# Altium schematic sheet ST_LINK_V2-1.SCHDOC: ST-LINK/V2-1
size A4; DocumentNumber: MB1219; Revision: B.1; SheetNumber: 15; SheetTotal: 17; Project: STM32F769I-EVAL
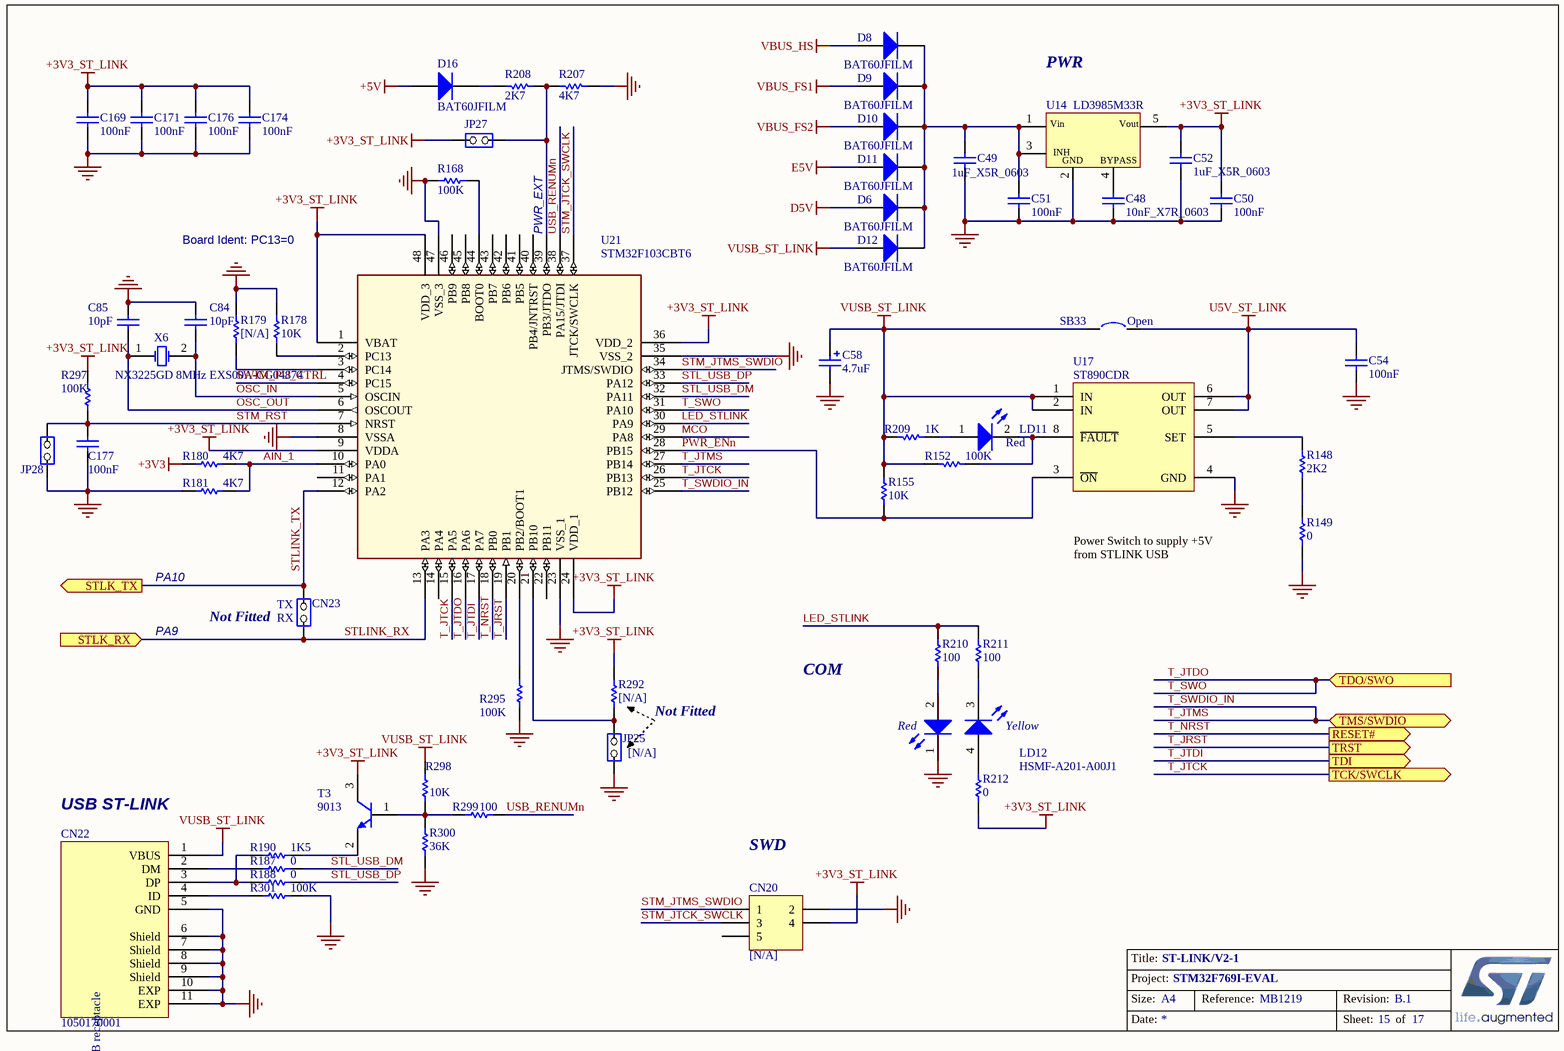
[diagram p0: ST_LINK_V2-1.SCHDOC]

## Parts
C48  10nF_X7R_0603  [0603C]
C49  1uF_X5R_0603  [0603C]
C50  100nF  [0603C]
C51  100nF  [0603C]
C52  1uF_X5R_0603  [0603C]
C54  100nF  [0603C]
C58  4.7uF  [TAN-A]
C84  10pF  [0603C]
C85  10pF  [0603C]
C169  100nF  [0603C]
C171  100nF  [0603C]
C174  100nF  [0603C]
C176  100nF  [0603C]
C177  100nF  [0603C]
CN20  [N/A]  [HDR_2X3-1_2R54-6]
CN22  1050170001  [Molex_1050170001]
CN23  (no value)  [SIP2]
D6  BAT60JFILM  [SOD-323]
D8  BAT60JFILM  [SOD-323]
D9  BAT60JFILM  [SOD-323]
D10  BAT60JFILM  [SOD-323]
D11  BAT60JFILM  [SOD-323]
D12  BAT60JFILM  [SOD-323]
D16  BAT60JFILM  [SOD-323]
JP25  [N/A]  [SIP2]
JP27  (no value)  [SIP2]
JP28  (no value)  [SIP2]
LD11  Red  [0603D]
LD12  HSMF-A201-A00J1  [LED2_3528]
R148  2K2  [0402R]
R149  0  [0603R]
R152  100K  [0603R]
R155  10K  [0402R]
R168  100K  [0603R]
R178  10K  [0603R]
R179  [N/A]  [0603R]
R180  4K7  [0603R]
R181  4K7  [0603R]
R187  0  [0603R]
R188  0  [0603R]
R190  1K5  [0603R]
R207  4K7  [0603R]
R208  2K7  [0603R]
R209  1K  [0603R]
R210  100  [0603R]
R211  100  [0603R]
R212  0  [0603R]
R292  [N/A]  [0603R]
R295  100K  [0603R]
R297  100K  [0603R]
R298  10K  [0603R]
R299  100  [0603R]
R300  36K  [0603R]
R301  100K  [0603R]
SB33  Open  [SB_0603]
T3  9013  [SOT-23]
U14  LD3985M33R  [SOT23-5]
U17  ST890CDR  [SOIC8_1R27_4R9X6]
U21  STM32F103CBT6  [LQFP48_0R5_9X9]
X6  NX3225GD 8MHz EXS00A-CG04874  [XTAL_2SM_3R2X2R5_H1]

## Ports
RESET# (out), STLK_RX (in), STLK_TX (out), TCK/SWCLK (out), TDI (out), TDO/SWO (in), TMS/SWDIO (bidir), TRST (out)

## Nets
+3V3: R180.1
+3V3_ST_LINK: C50.2 C52.1 C169.2 C171.2 C174.2 C176.2 CN20.4 JP27.1(COMMON) R212.2 R292.1 R297.2 T3.3(C) U14.5(Vout) U21.1(VBAT) U21.9(VDDA) U21.24(VDD_1) U21.36(VDD_2) U21.48(VDD_3)
+5V: D16.1(A)
D5V: D6.1(A)
E5V: D11.1(A)
GND: C48.1 C49.1 C50.1 C51.1 C52.2 C54.1 C58.2 C84.2 C85.2 C169.1 C171.1 C174.1 C176.1 C177.1 CN20.2 CN22.5(GND) CN22.6(Shield) CN22.7(Shield) CN22.8(Shield) CN22.9(Shield) CN22.10(EXP) CN22.11(EXP) JP25.1(COMMON) JP28.1(COMMON) LD12.1(RED_cathode) R149.1 R168.1 R178.1 R179.1 R181.1 R207.2 R295.1 R300.1 R301.2 U14.2(GND) U17.4(GND) U21.8(VSSA) U21.23(VSS_1) U21.35(VSS_2) U21.47(VSS_3)
U5V_ST_LINK: C54.2 SB33.2 U17.6(OUT) U17.7(OUT)
VBUS_FS1: D9.1(A)
VBUS_FS2: D10.1(A)
VBUS_HS: D8.1(A)
VUSB_ST_LINK: C58.1 CN22.1(VBUS) D12.1(A) R152.1 R155.1 R209.1 R298.2 SB33.1 U17.1(IN) U17.2(IN)
AIN_1: R180.2 R181.2 U21.10(PA0)
LED_STLINK: R210.1 R211.1 U21.30(PA9)
MCO: U21.29(PA8)
OSC_IN: C84.1 U21.5(OSCIN) X6.2(OSC2)
OSC_OUT: C85.1 U21.6(OSCOUT) X6.1(OSC1)
PWR_ENn: R155.2 U17.3(~{ON}) U21.28(PB15)
STL_USB_DM: R187.2 U21.32(PA11)
STL_USB_DP: R188.2 U21.33(PA12)
STLINK_RX: CN23.1(COMMON) U21.13(PA3) ; port STLK_RX
STLINK_TX: CN23.2(NO) U21.12(PA2) ; port STLK_TX
STM_JTCK_SWCLK: CN20.3 U21.37(JTCK/SWCLK)
STM_JTMS_SWDIO: CN20.1 U21.34(JTMS/SWDIO)
STM_RST: C177.2 JP28.2(NO) R297.1 U21.7(NRST)
SWIM_PU_CTRL: U21.4(PC15)
T_JRST: U21.19(PB1) ; port TRST
T_JTCK: U21.15(PA5) U21.26(PB13) ; port TCK/SWCLK
T_JTDI: U21.17(PA7) ; port TDI
T_JTDO: U21.16(PA6) U21.31(PA10) ; port TDO/SWO  [also labelled T_SWO]
T_JTMS: U21.25(PB12) U21.27(PB14) ; port TMS/SWDIO  [also labelled T_SWDIO_IN]
T_NRST: U21.18(PB0) ; port RESET#
USB_RENUMn: R299.2 U21.38(PA15/JTDI)
NetC48_2: C48.2 U14.4(BYPASS)
NetC49_2: C49.2 C51.2 D6.2(K) D8.2(K) D9.2(K) D10.2(K) D11.2(K) D12.2(K) U14.1(Vin) U14.3(CE)
NetCN22_2: CN22.2(DM) R187.1
NetCN22_3: CN22.3(DP) R188.1 R190.1
NetCN22_4: CN22.4(ID) R301.1
NetD16_2: D16.2(K) R208.1
NetJP25_2: JP25.2(NO) R292.2 U21.21(PB10)
NetJP27_2: JP27.2(NO) R207.1 R208.2 U21.39(PB3/JTDO)
NetLD11_1: LD11.1(A) R209.2
NetLD11_2: LD11.2(K) R152.2 U17.8(~{FAULT})
NetLD12_2: LD12.2(Red_anode) R210.2
NetLD12_3: LD12.3(YellowGreen_cathode) R211.2
NetLD12_4: LD12.4(YellowGreen_anode) R212.1
NetR148_1: R148.1 R149.2
NetR148_2: R148.2 U17.5(SET)
NetR168_2: R168.2 U21.44(BOOT0)
NetR178_2: R178.2 U21.2(PC13)
NetR179_2: R179.2 U21.3(PC14)
NetR190_2: R190.2 T3.2(E)
NetR295_2: R295.2 U21.20(PB2/BOOT1)
NetR298_1: R298.1 R299.1 R300.2 T3.1(B)

Not connected (* = marked no-connect by the designer): CN20 5; U21 11(PA1) 14(PA4) 22(PB11) 40(PB4/JNTRST) 41(PB5) 42(PB6) 43(PB7) 45(PB8) 46(PB9)

## Notes on the sheet
- PWR
- Board Ident: PC13=0
- (near U21) PWR_EXT
- PA10
- Power Switch to supply +5V from STLINK USB
- PA9
- (near CN23) Not Fitted
- (near CN23) TX
- (near CN23) RX
- Not Fitted
- COM
- (near CN22) USB ST-LINK
- SWD
- Title:
- Project:
- Size:
- Date:
- A4
- Reference:
- Sheet:
- Revision:
- of
- (in symbol 1050170001) USB_Micro-B receptacle
- (in symbol HSMF-A201-A00J1) Red; Yellow
- (in symbol LD3985M33R) INH

## Library data of the parts
C48 = CAP SMD 0603  X7R 10000PF 50V 10%: 0603  X7R 10NF; Order code RS: 2040779; Rated voltage: 50V; Tolerance: 10%; Order code Farnell: 7569548RL; Value: 10NF; Power: *; Technology: X7R; Temperature Factor: *; Temperature Min: -55°C; Temperature Max: +125°C; STS Code: *
C49 C52 = CAP SMD 0603  X5R 1µF 25V 10%: 0603  X5R 1µF; Rated voltage: 25V; Tolerance: 10%; Manufacturer: *; Manufacturer P/N: *; Order code Farnell: 1288202RL; Value: 1µF; Power: *; Technology: X5R; Temperature  Factor: *; Temperature Max: +125°C; Temperature Min: -55°C; STS Code: *
C50 C51 C54 C169 C171 C174 C176 C177 = Capacitor_ST: Capacitor 0402 / 0603 / 0805; Revision: July-2002: Re-released for DXP Platform.; Value: 100nF
C58 = Cap Pol1: Polarized Capacitor (Radial); Value: 100pF; Ordered by: Subcon; Published: 8-Jun-2000; Revision: July-2002: Re-released for DXP Platform.; Publisher: Altium Limited
C84 C85 = Capacitor_ST: Capacitor 0402 / 0603 / 0805; Value: 100nF; Revision: July-2002: Re-released for DXP Platform.
CN20 = Header 3X2: Header, 3-Pin, Dual row; Revision: 17-Jul-2002: Re-released for DXP Platform.; Publisher: Altium Limited
CN22 = 1050170001: Silkscreen: USB
CN23 = JP2: Fitted: NO
D6 D8-D12 = BAT60JFILM: Manuf_1: STM; Provided: ST; ECCN_US/EU: EAR99/NEC; Revision: July-2002: Re-released for DXP Platform.; Order: BAT60JFILM; Manuf_Part_1: BAT60JFILM; Distrib: ST
D16 = Diode: Default Diode; Code - JEDEC: DO-214-AB; Ordered by: STM; ECCN_US/EU: EAR99/NEC; Published: 8-Jun-2000; Revision: July-2002: Re-released for DXP Platform.; Publisher: Altium Limited
JP25 = JP2
JP27 JP28 = JP2: Ordered by: Subcon; Silkscreen: Pwr_ext
LD11 = LED2: Typical RED, GREEN, YELLOW, AMBER GaAs LED; Published: 8-Jun-2000; Revision: July-2002: Re-released for DXP Platform.; Publisher: Altium Limited
R148 R168 R187 R188 R190 R295 R297 R299 R301 = Resistor_ST: Resistor 0402 / 0603 / 0805; Description: Resistor 0402 or 0603 or 0805; Value: 10K
R149 R207 R208 R210-R212 R292 R298 R300 = Res1: Resistor; Value: 1K; Published: 8-Jun-2000; Revision: July-2002: Re-released for DXP Platform.; Publisher: Altium Limited
R152 = Res1: Resistor; Value: 1K; Ordered by: Subcon; Published: 8-Jun-2000; Revision: July-2002: Re-released for DXP Platform.; Publisher: Altium Limited
R155 R178 = Resistor_ST: Resistor 0402 / 0603 / 0805; Description: Resistor 0402 or 0603 or 0805; Value: 10K
R179-R181 = Resistor_ST: Resistor 0402 / 0603 / 0805; Description: Resistor 0402 or 0603 or 0805; Value: 10K; Fitted: NO
R209 = Res1: Resistor; Ordered by: Subcon; Published: 8-Jun-2000; Revision: July-2002: Re-released for DXP Platform.; Publisher: Altium Limited; Value: 1K
SB33 = Circuit Breaker: Published: 24-Mar-1999; Revision: July-2002: Re-released for DXP Platform.; Publisher: Altium Limited
T3 = NPN: NPN Bipolar Transistor; Code - JEDEC: TO-226-AA; Published: 8-Jun-2000; Revision: July-2002: Re-released for DXP Platform.; Publisher: Altium Limited
U14 = LD3985M33R: Ultra low drop-low noise BiCMOS voltage, regulators low ESR capacitors compatible; Manuf_1: STM; Provided: ST; Ref St: 9176161; ECCN_US/EU: EAR99/NEC; Manuf_Part_1: LD3985M33R; Distrib: ST; Order: LD3985M33R
U21 = STM32F103CBT6: Medium-density performance line ARM-based 32-bit MCU with 64KB Flash; Manuf_Part_1: STM32F103C8T6; Manuf_1: STM; Ref St: 9175981; Provided: ST; ECCN_US/EU: 3A991A2/NEC; Footprint: QFP48 7X7; Distrib: ST; Order: STM32F103C8T6
X6 = XTAL: Crystal Oscillator; Published: 8-Jun-2000; LatestRevisionDate: 17-Jul-2002; LatestRevisionNote: Re-released for DXP Platform.; PackageReference: R38; Publisher: Altium Limited